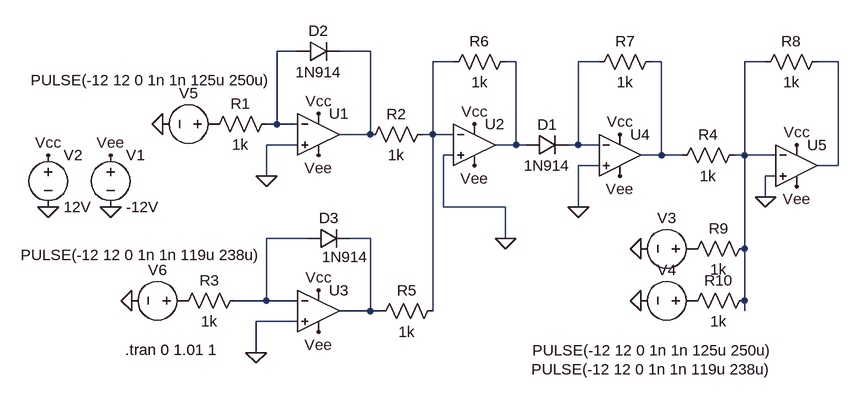
[diagram p0: schematic Mixer.asc]
Mixer.asc, the LTspice schematic file:
Version 4
SHEET 1 1156 680
WIRE 16 0 -16 0
WIRE 128 0 80 0
WIRE 256 16 224 16
WIRE 352 16 336 16
WIRE 480 16 448 16
WIRE 576 16 560 16
WIRE 736 16 704 16
WIRE 848 16 816 16
WIRE -16 112 -16 0
WIRE -16 112 -32 112
WIRE 16 112 -16 112
WIRE 128 128 128 0
WIRE 128 128 80 128
WIRE 224 128 224 16
WIRE 224 128 208 128
WIRE 256 128 224 128
WIRE 16 144 -32 144
WIRE 352 144 352 16
WIRE 352 144 320 144
WIRE 368 144 352 144
WIRE 448 144 448 16
WIRE 448 144 432 144
WIRE 480 144 448 144
WIRE 256 160 240 160
WIRE 576 160 576 16
WIRE 576 160 544 160
WIRE 608 160 576 160
WIRE 704 160 704 16
WIRE 704 160 688 160
WIRE 752 160 704 160
WIRE 480 176 448 176
WIRE 848 176 848 16
WIRE 848 176 816 176
WIRE -32 192 -32 144
WIRE 752 192 736 192
WIRE 736 224 736 192
WIRE 240 240 240 160
WIRE 336 240 240 240
WIRE 448 240 448 176
WIRE 32 288 -32 288
WIRE 128 288 96 288
WIRE 336 288 336 240
WIRE 704 304 704 160
WIRE -32 384 -32 288
WIRE -32 384 -80 384
WIRE 16 384 -32 384
WIRE 704 384 704 304
WIRE 128 400 128 288
WIRE 128 400 80 400
WIRE 144 400 128 400
WIRE 224 400 224 128
WIRE 704 400 704 384
WIRE 16 416 -48 416
WIRE -48 464 -48 416
FLAG -272 240 0
FLAG -368 240 0
FLAG -368 160 Vcc
FLAG -272 160 Vee
FLAG 48 96 Vcc
FLAG 288 112 Vcc
FLAG 48 368 Vcc
FLAG 512 128 Vcc
FLAG 784 144 Vcc
FLAG 48 160 Vee
FLAG 288 176 Vee
FLAG 512 192 Vee
FLAG 784 208 Vee
FLAG 48 432 Vee
FLAG 448 240 0
FLAG 336 288 0
FLAG -32 192 0
FLAG -48 464 0
FLAG 736 224 0
FLAG -240 384 0
FLAG -192 112 0
FLAG 544 304 0
FLAG 544 384 0
SYMBOL Opamps\\UniversalOpamp2 48 128 R0
SYMATTR InstName U1
SYMBOL Opamps\\UniversalOpamp2 288 144 R0
SYMATTR InstName U2
SYMBOL Opamps\\UniversalOpamp2 48 400 R0
SYMATTR InstName U3
SYMBOL Opamps\\UniversalOpamp2 512 160 R0
SYMATTR InstName U4
SYMBOL Opamps\\UniversalOpamp2 784 176 R0
SYMATTR InstName U5
SYMBOL voltage -272 144 R0
WINDOW 123 0 0 Left 2
WINDOW 39 0 0 Left 2
SYMATTR InstName V1
SYMATTR Value -12V
SYMBOL voltage -368 144 R0
WINDOW 123 0 0 Left 2
WINDOW 39 0 0 Left 2
SYMATTR InstName V2
SYMATTR Value 12V
SYMBOL res -16 96 R90
WINDOW 0 0 56 VBottom 2
WINDOW 3 32 56 VTop 2
SYMATTR InstName R1
SYMATTR Value 1k
SYMBOL res 224 112 R90
WINDOW 0 0 56 VBottom 2
WINDOW 3 32 56 VTop 2
SYMATTR InstName R2
SYMATTR Value 1k
SYMBOL res 704 144 R90
WINDOW 0 0 56 VBottom 2
WINDOW 3 32 56 VTop 2
SYMATTR InstName R4
SYMATTR Value 1k
SYMBOL diode 368 160 R270
WINDOW 0 32 32 VTop 2
WINDOW 3 0 32 VBottom 2
SYMATTR InstName D1
SYMATTR Value 1N914
SYMBOL res -64 368 R90
WINDOW 0 0 56 VBottom 2
WINDOW 3 32 56 VTop 2
SYMATTR InstName R3
SYMATTR Value 1k
SYMBOL res 240 384 R90
WINDOW 0 0 56 VBottom 2
WINDOW 3 32 56 VTop 2
SYMATTR InstName R5
SYMATTR Value 1k
SYMBOL res 352 0 R90
WINDOW 0 0 56 VBottom 2
WINDOW 3 32 56 VTop 2
SYMATTR InstName R6
SYMATTR Value 1k
SYMBOL res 576 0 R90
WINDOW 0 0 56 VBottom 2
WINDOW 3 32 56 VTop 2
SYMATTR InstName R7
SYMATTR Value 1k
SYMBOL res 832 0 R90
WINDOW 0 0 56 VBottom 2
WINDOW 3 32 56 VTop 2
SYMATTR InstName R8
SYMATTR Value 1k
SYMBOL diode 16 16 R270
WINDOW 0 32 32 VTop 2
WINDOW 3 0 32 VBottom 2
SYMATTR InstName D2
SYMATTR Value 1N914
SYMBOL diode 32 304 R270
WINDOW 0 32 32 VTop 2
WINDOW 3 3 57 VBottom 2
SYMATTR InstName D3
SYMATTR Value 1N914
SYMBOL res 720 288 R90
WINDOW 0 0 56 VBottom 2
WINDOW 3 32 56 VTop 2
SYMATTR InstName R9
SYMATTR Value 1k
SYMBOL res 720 368 R90
WINDOW 0 0 56 VBottom 2
WINDOW 3 32 56 VTop 2
SYMATTR InstName R10
SYMATTR Value 1k
SYMBOL voltage 640 304 R90
WINDOW 0 -32 56 VBottom 2
WINDOW 3 141 76 VTop 2
WINDOW 123 0 0 Left 2
WINDOW 39 0 0 Left 2
SYMATTR InstName V3
SYMATTR Value PULSE(-12 12 0 1n 1n 125u 250u)
SYMBOL voltage 640 384 R90
WINDOW 0 -32 56 VBottom 2
WINDOW 3 90 78 VTop 2
WINDOW 123 0 0 Left 2
WINDOW 39 0 0 Left 2
SYMATTR InstName V4
SYMATTR Value PULSE(-12 12 0 1n 1n 119u 238u)
SYMBOL voltage -96 112 R90
WINDOW 0 -32 56 VBottom 2
WINDOW 3 -83 113 VTop 2
WINDOW 123 0 0 Left 2
WINDOW 39 0 0 Left 2
SYMATTR InstName V5
SYMATTR Value PULSE(-12 12 0 1n 1n 125u 250u)
SYMBOL voltage -144 384 R90
WINDOW 0 -32 56 VBottom 2
WINDOW 3 -86 80 VTop 2
WINDOW 123 0 0 Left 2
WINDOW 39 0 0 Left 2
SYMATTR InstName V6
SYMATTR Value PULSE(-12 12 0 1n 1n 119u 238u)
TEXT -250 460 Left 2 !.tran 0 1.01 1

The netlist it stands for:
* Mixer.asc
XU1 0 N001 Vcc Vee N002 level.2 Avol=1Meg GBW=10Meg Slew=10Meg ilimit=25m rail=0 Vos=0 phimargin=45 en=0 enk=0 in=0 ink=0 Rin=500Meg  ; pins IN+ IN- V+ V- OUT
XU2 0 N003 Vcc Vee N004 level.2 Avol=1Meg GBW=10Meg Slew=10Meg ilimit=25m rail=0 Vos=0 phimargin=45 en=0 enk=0 in=0 ink=0 Rin=500Meg  ; pins IN+ IN- V+ V- OUT
XU3 0 N009 Vcc Vee N010 level.2 Avol=1Meg GBW=10Meg Slew=10Meg ilimit=25m rail=0 Vos=0 phimargin=45 en=0 enk=0 in=0 ink=0 Rin=500Meg  ; pins IN+ IN- V+ V- OUT
XU4 0 N005 Vcc Vee N006 level.2 Avol=1Meg GBW=10Meg Slew=10Meg ilimit=25m rail=0 Vos=0 phimargin=45 en=0 enk=0 in=0 ink=0 Rin=500Meg  ; pins IN+ IN- V+ V- OUT
XU5 0 N007 Vcc Vee N008 level.2 Avol=1Meg GBW=10Meg Slew=10Meg ilimit=25m rail=0 Vos=0 phimargin=45 en=0 enk=0 in=0 ink=0 Rin=500Meg  ; pins IN+ IN- V+ V- OUT
V1 Vee 0 -12V
V2 Vcc 0 12V
R1 N001 P001 1k
R2 N003 N002 1k
R4 N007 N006 1k
D1 N004 N005 1N914
R3 N009 P002 1k
R5 N003 N010 1k
R6 N004 N003 1k
R7 N006 N005 1k
R8 N008 N007 1k
D2 N001 N002 1N914
D3 N009 N010 1N914
R9 N007 P003 1k
R10 N007 P004 1k
V3 P003 0 PULSE(-12 12 0 1n 1n 125u 250u)
V4 P004 0 PULSE(-12 12 0 1n 1n 119u 238u)
V5 P001 0 PULSE(-12 12 0 1n 1n 125u 250u)
V6 P002 0 PULSE(-12 12 0 1n 1n 119u 238u)
.model D D
.lib standard.dio
.tran 0 1.01 1
.lib UniversalOpamps2.sub
.backanno
.end